# Altium schematic sheet SCHEMATIC.SchDoc
size A4
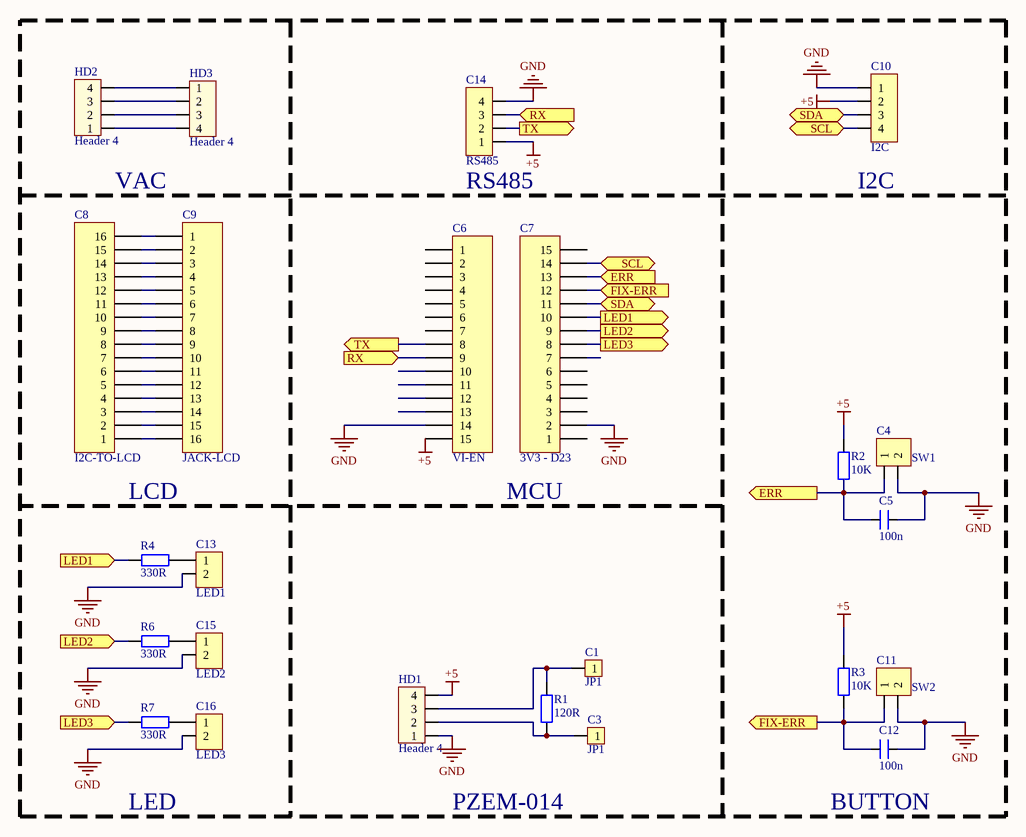
[diagram p0: SCHEMATIC.SchDoc]

## Parts
C1  JP1  [JP1-D1T]
C3  JP1  [JP1-D1T]
C4  SW1  [Header2]
C5  100n  [SM-0805]
C6  VI-EN  [JP15-C1T]
C7  3V3 - D23  [JP15-C1T]
C8  I2C-TO-LCD  [JP16-C1T]
C9  JACK-LCD  [JP16-C1T]
C10  I2C  [JP4-C1T]
C11  SW2  [Header2]
C12  100n  [SM-0805]
C13  LED1  [Header2]
C14  RS485  [JP4-C1T]
C15  LED2  [Header2]
C16  LED3  [Header2]
HD1  Header 4  [HED4]
HD2  Header 4  [HED4]
HD3  Header 4  [HED4T]
R1  120R  [SM-RES-0805]
R2  10K  [SM-RES-0805]
R3  10K  [SM-RES-0805]
R4  330R  [SM-RES-0805]
R6  330R  [SM-RES-0805]
R7  330R  [SM-RES-0805]

## Ports
ERR (in), ERR (out), FIX-ERR (in), FIX-ERR (out), LED1 (in), LED1 (out), LED2 (in), LED2 (out), LED3 (in), LED3 (out), RX (in), SCL (bidir), SDA (bidir), TX (out)

## Nets
+5: C6.15 C10.2 C14.1 HD1.4 R2.1 R3.1
GND: C4.2 C5.1 C6.14 C7.2 C10.1 C11.2 C12.1 C13.2 C14.4 C15.2 C16.2 HD1.1
ERR: C4.1 C5.2 C7.13 R2.2 ; port ERR
FIX-ERR: C7.12 C11.1 C12.2 R3.2 ; port FIX-ERR
LED1: C7.10 R4.1 ; port LED1
LED2: C7.9 R6.1 ; port LED2
LED3: C7.8 R7.1 ; port LED3
RX: C6.9 C14.3 ; port RX
SCL: C7.14 C10.4 ; port SCL
SDA: C7.11 C10.3 ; port SDA
TX: C6.8 C14.2 ; port TX
NetC1_1: C1.1 HD1.3 R1.1
NetC3_1: C3.1 HD1.2 R1.2
NetC8_1: C8.1 C9.16
NetC8_2: C8.2 C9.15
NetC8_3: C8.3 C9.14
NetC8_4: C8.4 C9.13
NetC8_5: C8.5 C9.12
NetC8_6: C8.6 C9.11
NetC8_7: C8.7 C9.10
NetC8_8: C8.8 C9.9
NetC8_9: C8.9 C9.8
NetC8_10: C8.10 C9.7
NetC8_11: C8.11 C9.6
NetC8_12: C8.12 C9.5
NetC8_13: C8.13 C9.4
NetC8_14: C8.14 C9.3
NetC8_15: C8.15 C9.2
NetC8_16: C8.16 C9.1
NetC13_1: C13.1 R4.2
NetC15_1: C15.1 R6.2
NetC16_1: C16.1 R7.2
NetHD2_1: HD2.1 HD3.4
NetHD2_2: HD2.2 HD3.3
NetHD2_3: HD2.3 HD3.2
NetHD2_4: HD2.4 HD3.1

Not connected (* = marked no-connect by the designer): C6 1 2 3 4 5 6 7 10 11 12 13; C7 1 3 4 5 6 7 15

## Notes on the sheet
- VAC
- (near C14) RS485
- (near C10) I2C
- LCD
- MCU
- LED
- PZEM-014
- (near C12) BUTTON

## Library data of the parts
C1 C3 = JP1: WR-PHD 2.54 mm Angled Socket Header; Manufacturer: W¨¹rth Elektronik eiSos GmbH; partNo: 613002143121; ComponentLink1 Description: Manufacturer; ComponentLink2 Description: Datasheet; NoPins: 02; Created Date: 29 March 2013; ComponentLink1URL: http://www.we-online.com; ComponentLink2URL: http://katalog.we-online.de/em/datasheet/6130xx143121.pdf; Created by: Karrer Zheng
C4 C11 C13 C15 C16 = Header2: Header IDC, 2 x 1 Pin Vertical 2.54mm Pitch (Non-Boxed, Male); Manufacturer: W¨¹rth Elektronik eiSos GmbH; partNo: 613002143121; ComponentLink1 Description: Manufacturer; ComponentLink2 Description: Datasheet; NoPins: 02; Created Date: 29 March 2013; ComponentLink1URL: http://www.we-online.com; ComponentLink2URL: http://katalog.we-online.de/em/datasheet/6130xx143121.pdf; Created by: Karrer Zheng
C5 C12 = CM: Cap SMD; Value: 103
C6 C7 = JP15: WR-PHD 2.54 mm Angled Socket Header; Manufacturer: W¨¹rth Elektronik eiSos GmbH; partNo: 613015143121; ComponentLink1 Description: Manufacturer; ComponentLink2 Description: Datasheet; NoPins: 15; Created Date: 29 March 2013; ComponentLink1URL: http://www.we-online.com; ComponentLink2URL: http://katalog.we-online.de/em/datasheet/6130xx143121.pdf; Created by: Karrer Zheng
C8 C9 = JP16: WR-PHD 2.54 mm Angled Socket Header; Manufacturer: W¨¹rth Elektronik eiSos GmbH; partNo: 613016143121; ComponentLink1 Description: Manufacturer; ComponentLink2 Description: Datasheet; NoPins: 16; Created Date: 29 March 2013; ComponentLink1URL: http://www.we-online.com; ComponentLink2URL: http://katalog.we-online.de/em/datasheet/6130xx143121.pdf; Created by: Karrer Zheng
C10 C14 = JP4: WR-PHD 2.54 mm Angled Socket Header; Manufacturer: W¨¹rth Elektronik eiSos GmbH; partNo: 613004143121; ComponentLink1 Description: Manufacturer; ComponentLink2 Description: Datasheet; NoPins: 04; Created Date: 29 March 2013; ComponentLink1URL: http://www.we-online.com; ComponentLink2URL: http://katalog.we-online.de/em/datasheet/6130xx143121.pdf; Created by: Karrer Zheng
HD1-HD3 = Hed4: Header 4 (Green); Value: Header 4
R1-R4 R6 R7 = R1/4W: Resistor 1/4W; Value: R1/4W - 1K